# EAGLE design Oxport Project (EAGLE 9.6.2)
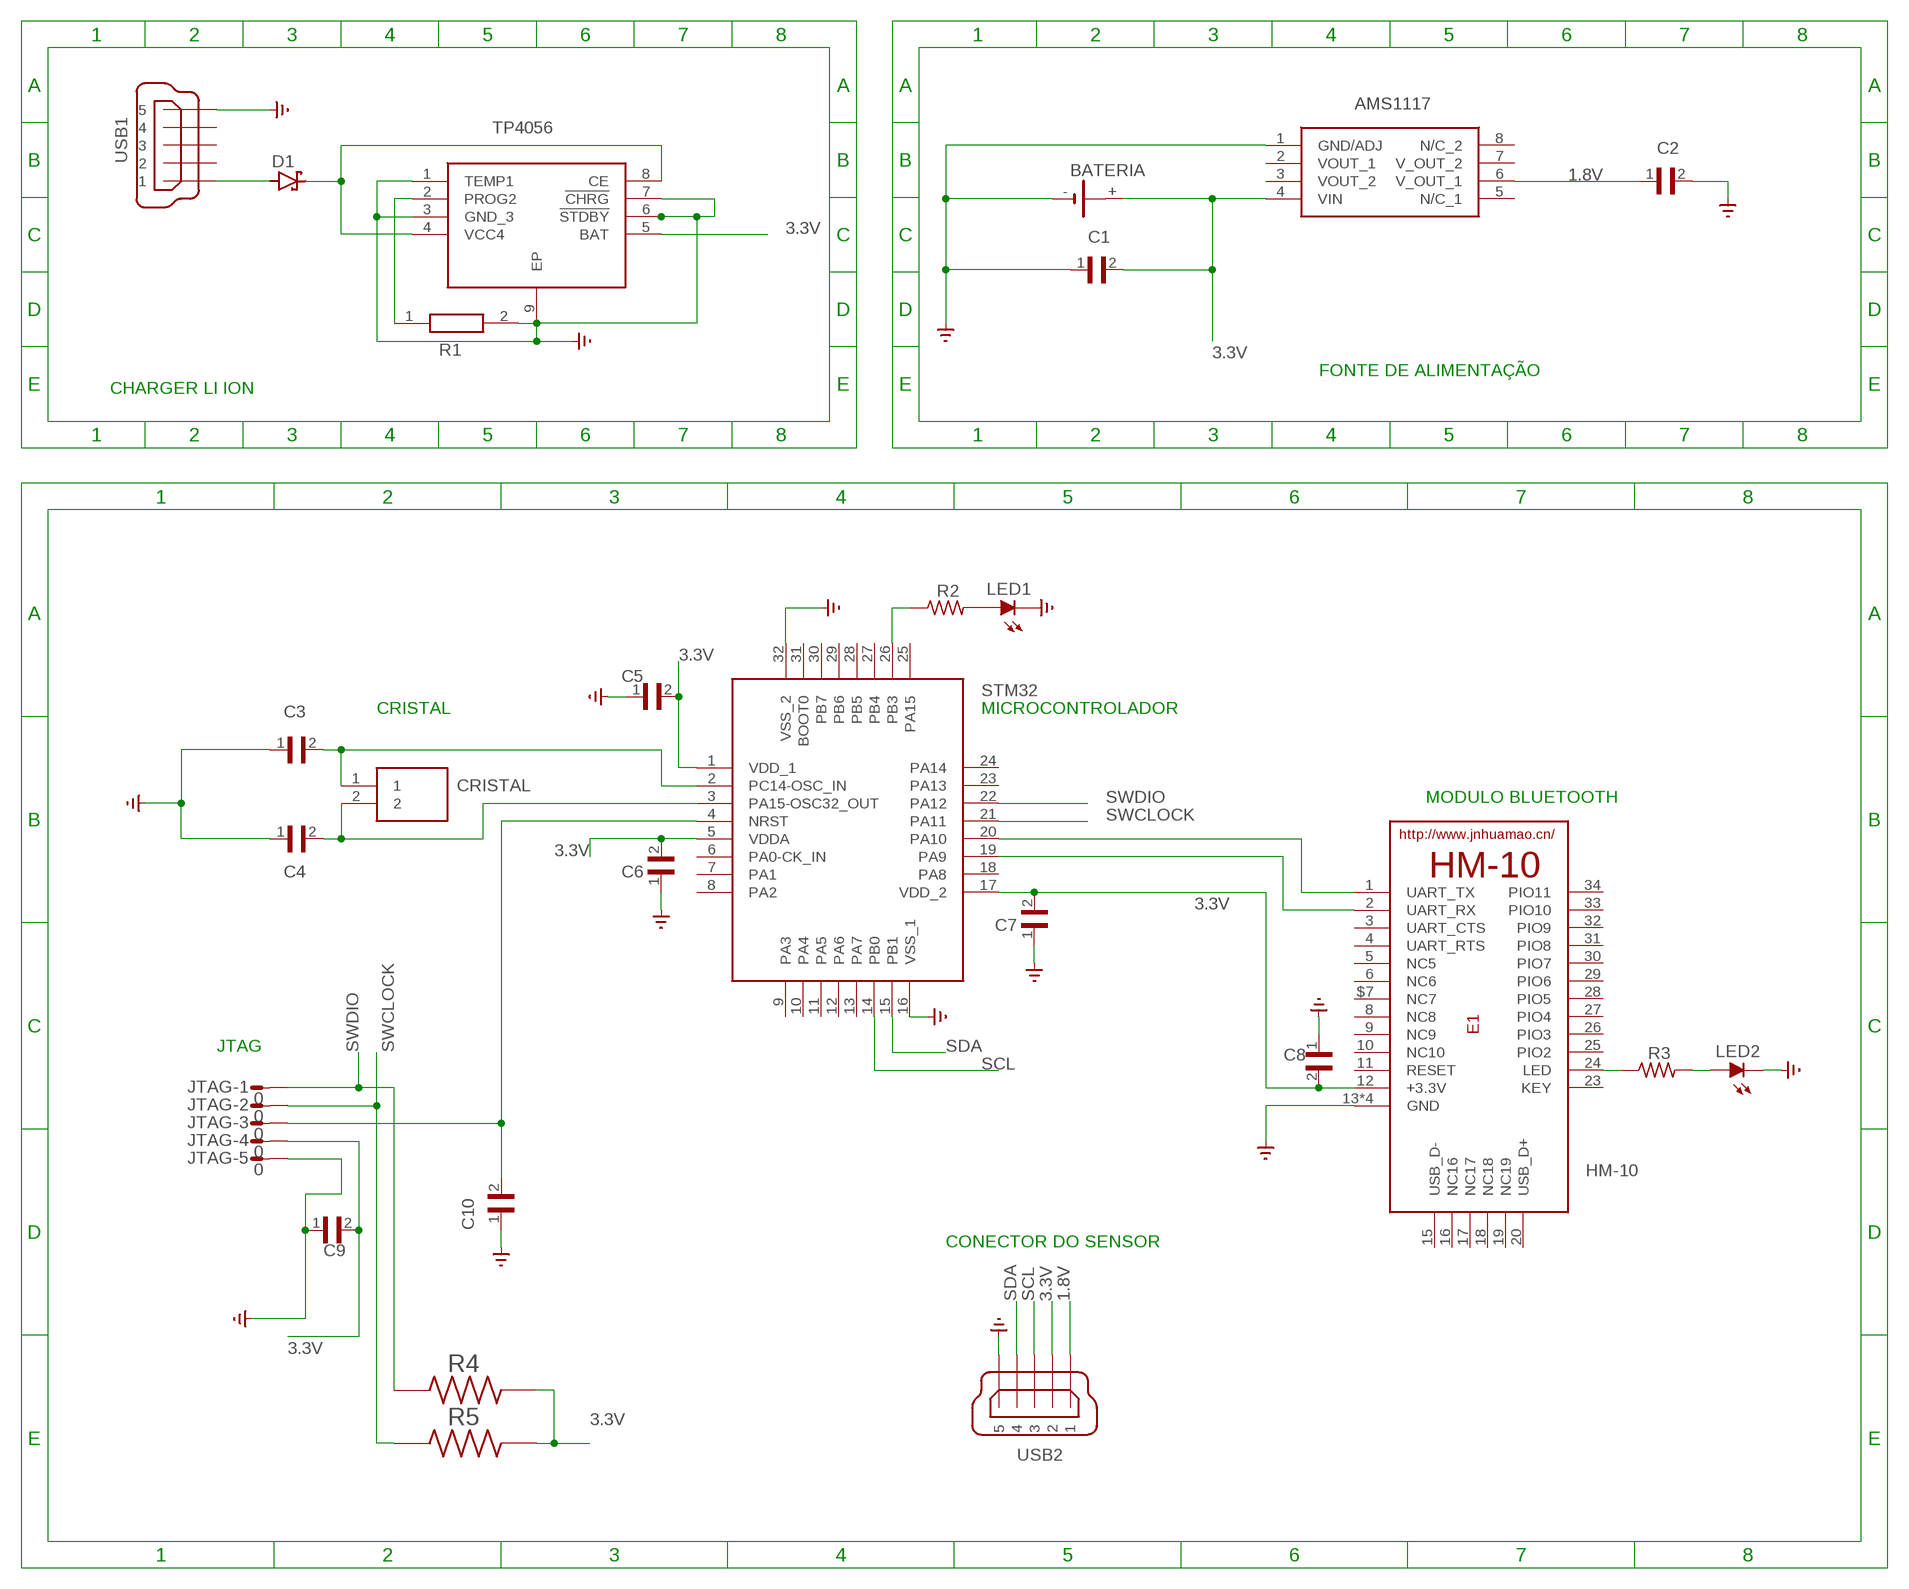
[diagram p0: schematic, sheet 1]

## Parts
3.3V  STM32L031K6T6TR  [QFP80P900X900X160-32N]
BATERIA  CR1/2  [CR1/2]
C1  VJ0603Y104KLXAC5G  [CAPC1608X92N]
C2  VJ0603Y104KLXAC5G  [CAPC1608X92N]
C3  GRM1885C2A4R3CZ01D  [CAPC1608X90N]
C4  GRM1885C2A4R3CZ01D  [CAPC1608X90N]
C5  VJ0603Y104KLXAC5G  [CAPC1608X92N]
C6  VJ0603Y104KLXAC5G  [CAPC1608X92N]
C7  VJ0603Y104KLXAC5G  [CAPC1608X92N]
C8  VJ0603Y104KLXAC5G  [CAPC1608X92N]
C9  VJ0603Y104KLXAC5G  [CAPC1608X92N]
C10  VJ0603Y104KLXAC5G  [CAPC1608X92N]
CRISTAL  NX3215SA-32.768K-EXS00A-MU0000  [NX3215SA32768KEXS00AMU00003]
D1  BAT60J  [SOD323_ST]
E1  HM-10-BOARD  [26.9X13X2.2_BOARD]
IC2  AMS1117CS-1.8  [SOIC127P599X175-8N]
J1  TP4056  [SOIC127P600X175-9N]
JTAG  0  L05P  [L05P]
LED1  1  LED_LEDCHIP-LED0603MP  [LED_CHIP-LED0603MP]
LED2  1  LED_LEDCHIP-LED0603MP  [LED_CHIP-LED0603MP]
MINI_USB  MINI-USB_SHIELD5P4-32005-501  [32005-501]
R1  CRCW08051K00FKEB  [RESC2012X50N]
R2  1623232-1  [RESC2012X65N]
R3  1623232-1  [RESC2012X65N]
R4  CRGCQ1206J10K  [RESC3115X65N]
R5  CRGCQ1206J10K  [RESC3115X65N]
USB1  MINI-USB_SHIELD5P4-32005-501  [32005-501]

## Nets
1.8V: C2.1 IC2.6(V_OUT_1) USB1.1
3.3V: 3.3V.1(VDD_1) 3.3V.5(VDDA) 3.3V.17(VDD_2) BATERIA.+ C1.2 C5.2 C6.2 C7.2 C8.2 C9.2 E1.12(+3.3V) IC2.4(VIN) J1.5(BAT) JTAG.4 R4.2 R5.2 USB1.2
GND: 3.3V.16(VSS_1) 3.3V.32(VSS_2) BATERIA.- C1.1 C2.2 C3.1 C4.1 C5.1 C6.1 C7.1 C8.1 C9.1 C10.1 E1.13(GND) E1.14(GND) E1.21(GND) E1.22(GND) IC2.1(GND/ADJ) J1.1(TEMP1) J1.3(GND_3) J1.6(!STDBY) J1.7(!CHRG) J1.9(EP) JTAG.5 LED1.C LED2.C MINI_USB.5 R1.2 USB1.5 ; supply symbol labelled SUPPLY0_GND_
N$1: D1.A MINI_USB.1
N$2: 3.3V.2(PC14-OSC_IN) C3.2 CRISTAL.1
N$3: 3.3V.3(PA15-OSC32_OUT) C4.2 CRISTAL.2
N$5: 3.3V.20(PA10) E1.1(UART_TX)
N$6: 3.3V.19(PA9) E1.2(UART_RX)
N$7: 3.3V.26(PB3) R2.1
N$8: E1.24(LED) R3.1
N$9: LED2.A R3.2
N$11: LED1.A R2.2
N$12: D1.C J1.4(VCC4) J1.8(CE)
N$14: J1.2(PROG2) R1.1
RESET: 3.3V.4(NRST) C10.2 JTAG.3
SCL: 3.3V.14(PB0) USB1.3
SDA: 3.3V.15(PB1) USB1.4
SWCLOCK: 3.3V.21(PA11) JTAG.2 R5.1
SWDIO: 3.3V.22(PA12) JTAG.1 R4.1
Unconnected: 3.3V.6(PA0-CK_IN) 3.3V.7(PA1) 3.3V.8(PA2) 3.3V.9(PA3) 3.3V.10(PA4) 3.3V.11(PA5) 3.3V.12(PA6) 3.3V.13(PA7) 3.3V.18(PA8) 3.3V.23(PA13) 3.3V.24(PA14) 3.3V.25(PA15) 3.3V.27(PB4) 3.3V.28(PB5) 3.3V.29(PB6) 3.3V.30(PB7) 3.3V.31(BOOT0) BATERIA.+@1(+) E1.3(UART_CTS) E1.4(UART_RTS) E1.5(NC5) E1.6(NC6) E1.8(NC8) E1.9(NC9) E1.10(NC10) E1.11(RESET) E1.15(USB_D-) E1.16(NC16) E1.17(NC17) E1.18(NC18) E1.19(NC19) E1.20(USB_D+) E1.23(KEY) E1.25(PIO2) E1.26(PIO3) E1.27(PIO4) E1.28(PIO5) E1.29(PIO6) E1.30(PIO7) E1.31(PIO8) E1.32(PIO9) E1.33(PIO10) E1.34(PIO11) E1.$7(NC7) IC2.2(VOUT_1) IC2.3(VOUT_2) IC2.5(N/C_1) IC2.7(V_OUT_2) IC2.8(N/C_2) MINI_USB.2 MINI_USB.3 MINI_USB.4 MINI_USB.M1(S1) MINI_USB.M2(S2) MINI_USB.M3(S3) MINI_USB.M4(S4) USB1.M1(S1) USB1.M2(S2) USB1.M3(S3) USB1.M4(S4)

## Notes on the sheet
- AMS1117
- USB1
- FONTE DE ALIMENTAÇÃO
- CHARGER LI ION
- STM32
- CRISTAL | MICROCONTROLADOR
- MODULO BLUETOOTH
- JTAG
- HM-10
- CONECTOR DO SENSOR
- USB2

## Library data of the parts
3.3V = STM32L031K6T6TR:STM32L031K6T6TR: STMICROELECTRONICS - STM32L031K6T6TR - ARM MCU, STM32 Family STM32L0 Series Microcontrollers, ARM Cortex-M0+, 32bit, 32 MHz, 32 KB, 8 KB Source: Datasheet <https://4donline.ihs.com/images/VipMasterIC/IC/SGST/SGST-S-A0002219924/SGST-S-A0002219924-1.pdf?hkey=6D3A4C79FDBF58556ACFDE234799DDF0>; ARROW_PART_NUMBER: STM32L031K6T6TR; ARROW_PRICE-STOCK: https://www.arrow.com/en/products/stm32l031k6t6tr/stmicroelectronics; DESCRIPTION: STMICROELECTRONICS - STM32L031K6T6TR - ARM MCU, STM32 Family STM32L0 Series Microcontrollers, ARM Cortex-M0+, 32bit, 32 MHz, 32 KB, 8 KB; HEIGHT: 1.6mm; MANUFACTURER_NAME: STMicroelectronics; MANUFACTURER_PART_NUMBER: STM32L031K6T6TR; MOUSER_PART_NUMBER: 511-STM32L031K6T6TR; MOUSER_PRICE-STOCK: https://www.mouser.co.uk/ProductDetail/STMicroelectronics/STM32L031K6T6TR/?qs=xwQlLnDx56Cmxri8cgW0QQ%3D%3D
BATERIA = battery:CR1/2: LI BATTERY Sonnenschein SL-350 PT
C1 C2 C5-C10 = VJ0603Y104KLXAC5G:VJ0603Y104KLXAC5G: Multilayer Ceramic Capacitors MLCC - SMD/SMT 100nF 25volts 10% Check prices <https://pricing.snapeda.com/parts/VJ0603Y104KLXAC5G/Vishay/view-part?ref=eda>; AVAILABILITY: Warning; DESCRIPTION: Multilayer Ceramic Capacitors MLCC - SMD/SMT 100nF 25volts 10%; MF: Vishay; MP: VJ0603Y104KLXAC5G; PACKAGE: 0603 Vishay; PRICE: None; PURCHASE-URL: https://pricing.snapeda.com/search/part/VJ0603Y104KLXAC5G/?ref=eda
C3 C4 = GRM1885C2A4R3CZ01D:GRM1885C2A4R3CZ01D: Check prices <https://pricing.snapeda.com/parts/GRM1885C2A4R3CZ01D/Murata/view-part?ref=eda>; AVAILABILITY: Bad; DESCRIPTION: 4.3pF ±0.25pF 100V Ceramic Capacitor C0G, NP0 0603 (1608 Metric); MF: Murata; MP: GRM1885C2A4R3CZ01D; PACKAGE: 1608 Murata; PRICE: None
CRISTAL = NX3215SA-32.768K-EXS00A-MU0000:NX3215SA-32.768K-EXS00A-MU0000: Crystals CRYSTAL 32.768KHZ 12.5PF SMD Source: Datasheet <https://media.digikey.com/pdf/Data Sheets/NDK PDFs/NX3215SA-32.768kHz-EXS00A-MU00003.pdf>; DESCRIPTION: Crystals CRYSTAL 32.768KHZ 12.5PF SMD; HEIGHT: 0.9mm; MANUFACTURER_NAME: NDK; MANUFACTURER_PART_NUMBER: NX3215SA-32.768K-EXS00A-MU00003; MOUSER_PART_NUMBER: 344-NX3215SA32.768K3; MOUSER_PRICE-STOCK: https://www.mouser.co.uk/ProductDetail/NDK/NX3215SA-32768K-EXS00A-MU00003?qs=w%2Fv1CP2dgqrE9YNksyAN9A%3D%3D
D1 = diode:BAT60J: Schottky barrier diode Source: www.st.com, BAT60J.pdf
E1 = JNHuaMao:HM-10: HM Bluetooth module use TI CC2540 or CC2541, Master and slave roles in one, transmission version and remote control version and PIO state acquisition functions in one, Support the AT command modify module parameters, Convenient and flexible.
IC2 = AMS1117CS-1.8:AMS1117CS-1.8: 1A LOW DROPOUT VOLTAGE REGULATOR Source: Datasheet <https://datasheet.datasheetarchive.com/originals/distributors/Datasheets-28/DSA-550594.pdf>; DESCRIPTION: 1A LOW DROPOUT VOLTAGE REGULATOR; HEIGHT: 1.752mm; MANUFACTURER_NAME: Advanced Monolithic Systems; MANUFACTURER_PART_NUMBER: AMS1117CS-1.8
J1 = TP4056:TP4056: 1A Standalone Linear Li-lon Battery Charger, SOP-8 Source: Datasheet <https://dlnmh9ip6v2uc.cloudfront.net/datasheets/Prototyping/TP4056.pdf>; DESCRIPTION: 1A Standalone Linear Li-lon Battery Charger, SOP-8; HEIGHT: 1.75mm; MANUFACTURER_NAME: NanJing Top Power; MANUFACTURER_PART_NUMBER: TP4056
JTAG = con-amp-mt:L05P: AMP MT CONNECTOR; OC_FARNELL: unknown; OC_NEWARK: unknown
LED1 LED2 = 52101-101-REV-A_v16:LED_LED: LED Various Types
MINI_USB USB1 = con-cypressindustries:MINI-USB_SHIELD5P4-: MINI USB-B R/A W/O POST 5 pol. Source: www.cypressindustries.com; OC_FARNELL: unknown; OC_NEWARK: unknown
R1 = CRCW08051K00FKEB:CRCW08051K00FKEB: VISHAY - CRCW08051K00FKEB - RES, THICK FILM, 1K, 1%, 0.125W, 0805, REEL Source: Datasheet <http://www.vishay.com/docs/20035/dcrcwe3.pdf>; ARROW_PART_NUMBER: CRCW08051K00FKEB; ARROW_PRICE-STOCK: https://www.arrow.com/en/products/crcw08051k00fkeb/vishay; DESCRIPTION: VISHAY - CRCW08051K00FKEB - RES, THICK FILM, 1K, 1%, 0.125W, 0805, REEL; HEIGHT: 0.5mm; MANUFACTURER_NAME: Vishay; MANUFACTURER_PART_NUMBER: CRCW08051K00FKEB; MOUSER_PART_NUMBER: 71-CRCW08051K00FKEB; MOUSER_PRICE-STOCK: https://www.mouser.co.uk/ProductDetail/Vishay-Dale/CRCW08051K00FKEB/?qs=DZvKvnD5UYWgZ7Jd5X5uKQ%3D%3D
R2 R3 = 1623232-1:1623232-1: CRG0805 1% 470R Check prices <https://pricing.snapeda.com/parts/1623232-1/TE%20Connectivity/view-part?ref=eda>; AVAILABILITY: Warning; COMMENT: 1623232-1; DESCRIPTION: 470 Ohms ±1% 0.125W, 1/8W Chip Resistor 0805 (2012 Metric) Thick Film; EU_ROHS_COMPLIANCE: Compliant with Exemptions; MF: TE Connectivity; MP: 1623232-1; PACKAGE: 0805; POWER_RATING: .125 W; PRICE: None; RESISTANCE: 470; TOLERANCE: 1%; VOLTAGE_RATING: 150 V
R4 R5 = CRGCQ1206J10K:CRGCQ1206J10K: Fixed Resistor CRGCQ 1206 10K 5% Check prices <https://pricing.snapeda.com/parts/CRGCQ1206J10K/TE%20Connectivity/view-part?ref=eda>; AVAILABILITY: Warning; COMMENT: 2-2176344-5; DESCRIPTION: Fixed Resistor CRGCQ 1206 10K 5%; MF: TE Connectivity; MP: CRGCQ1206J10K; PACKAGE: 3115 TE Connectivity; PRICE: None; PURCHASE-URL: https://pricing.snapeda.com/search/part/CRGCQ1206J10K/?ref=eda

## Board
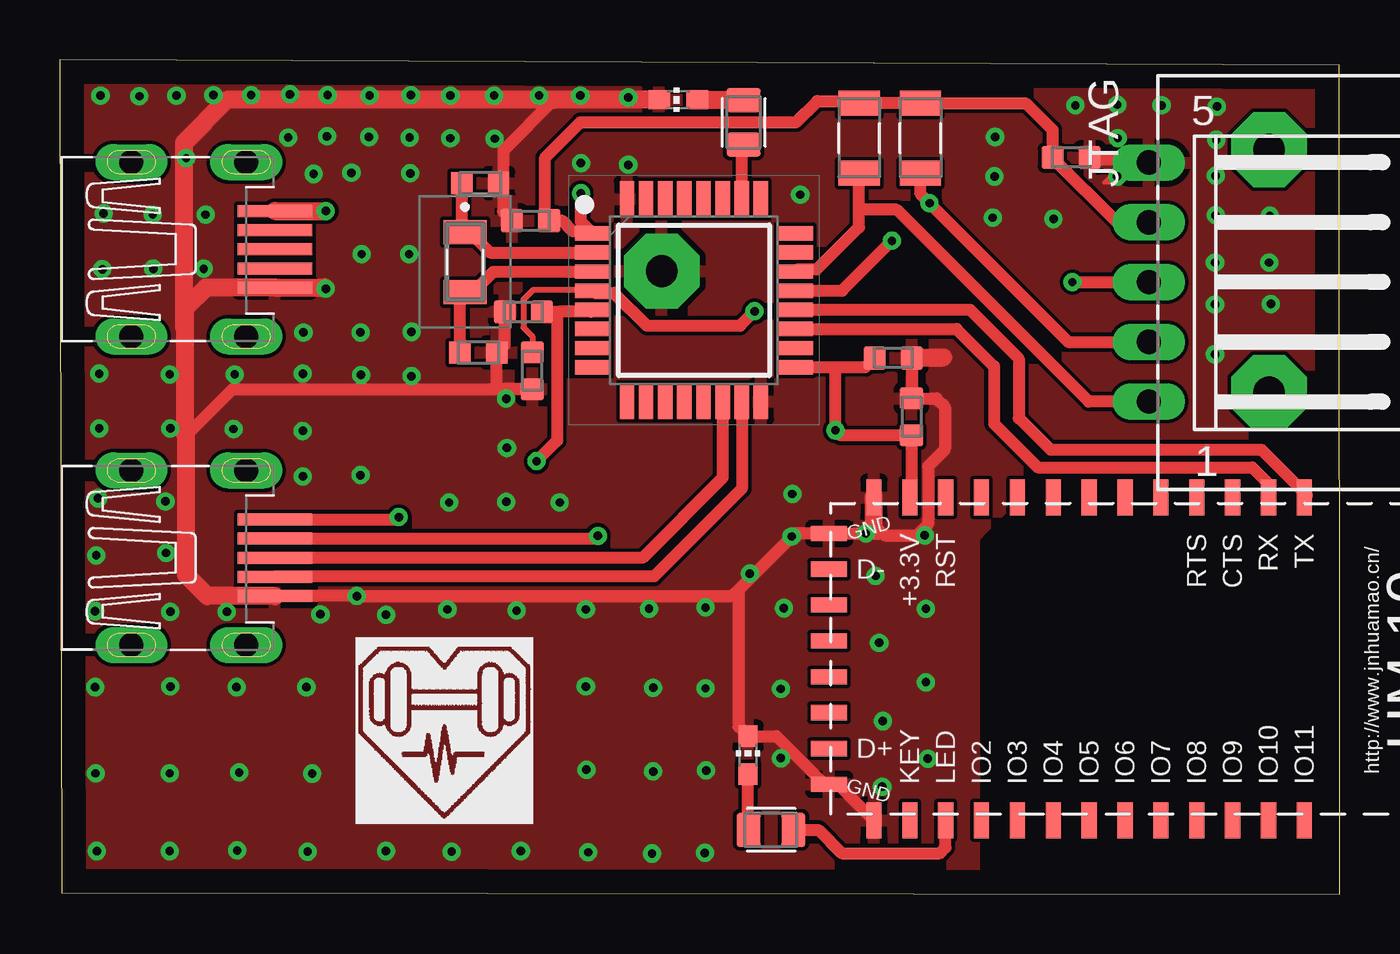
[diagram p1: board, top side]
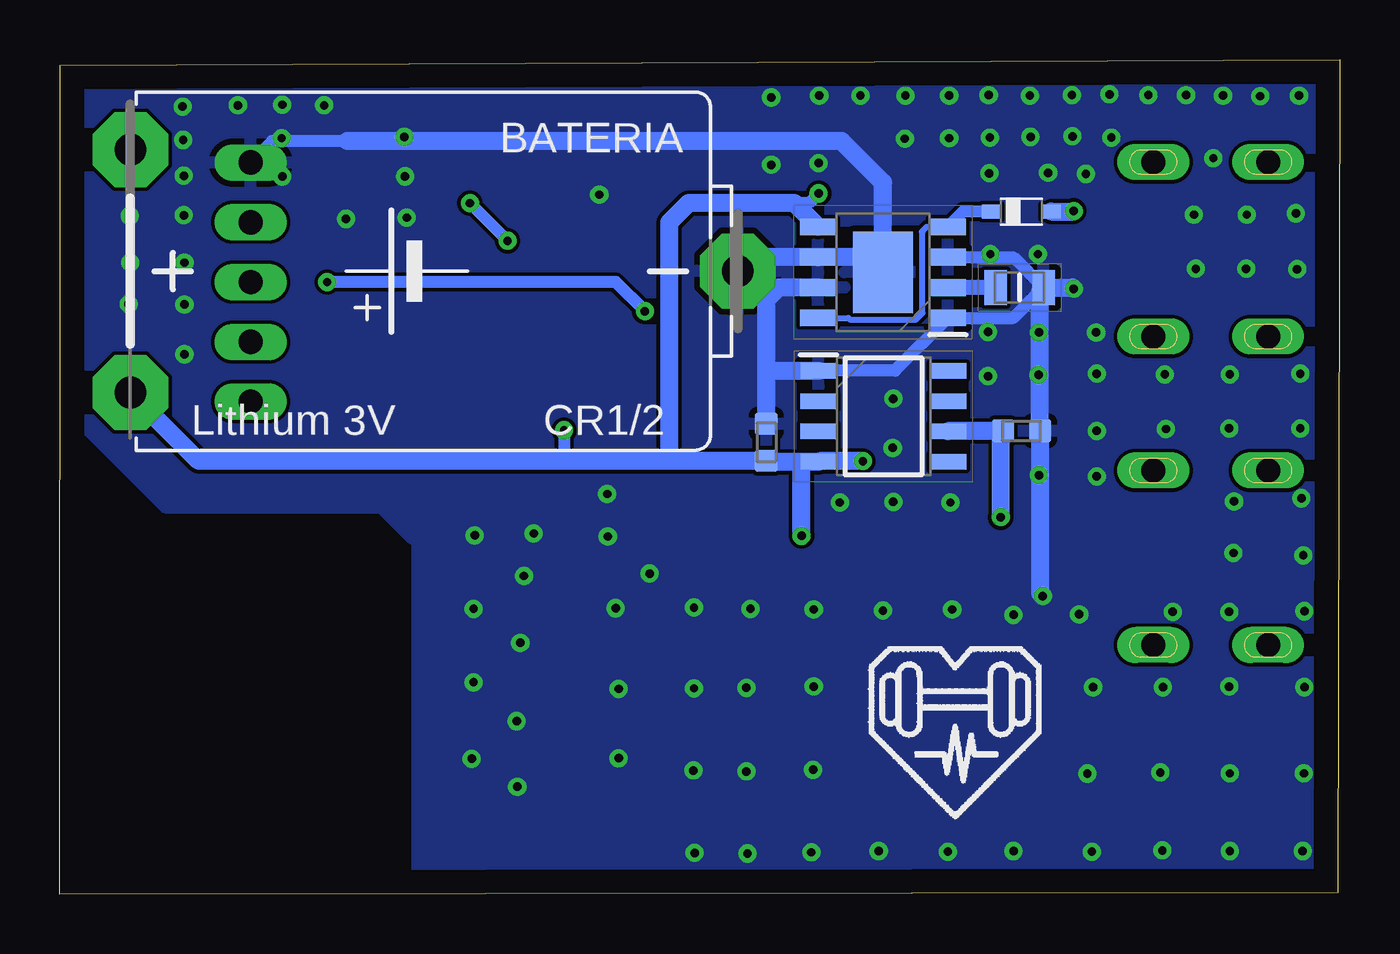
[diagram p2: board, bottom side, seen from below]

Size 53.52 x 34.9 mm. Coordinates in mm from the lower left corner, seen from the top.
Outline: 0.08,0.05 53.52,0 53.5,34.67 0,34.9 0.08,0.05
Copper layers (1*16): Top 0.035mm / dielectric 1.5mm / Bottom 0.035mm
Design rules "default": minimum track width 6mil, minimum drill 0.35mm, track to track 6mil, track to pad 6mil, pad to pad 6mil, via to via 6mil, smd to smd 6mil, copper to edge 40mil, drill to drill 6mil, minimum pad ring 10mil, minimum via ring 8mil, stop-mask expansion 4mil, vias tented up to drill 0mil, thermal gap 10mil

### Footprints (pad centres in the part's own frame; a part is rotated, then mirrored left to right if it is on the bottom)
QFP80P900X900X160-32N = smd 1.475 x 0.6: 1 -4.238,2.8; 2 -4.238,2; 3 -4.238,1.2; 4 -4.238,0.4; 5 -4.238,-0.4; 6 -4.238,-1.2; 7 -4.238,-2; 8 -4.238,-2.8; 17 4.238,-2.8; 18 4.238,-2; 19 4.238,-1.2; 20 4.238,-0.4; 21 4.238,0.4; 22 4.238,1.2; 23 4.238,2; 24 4.238,2.8 | smd 0.6 x 1.475: 9 -2.8,-4.238; 10 -2,-4.238; 11 -1.2,-4.238; 12 -0.4,-4.238; 13 0.4,-4.238; 14 1.2,-4.238; 15 2,-4.238; 16 2.8,-4.238; 25 2.8,4.238; 26 2,4.238; 27 1.2,4.238; 28 0.4,4.238; 29 -0.4,4.238; 30 -1.2,4.238; 31 -2,4.238; 32 -2.8,4.238
CR1/2 = drill 1.321 pad 3.15 octagon: + -12.7,-5.08; +@1 -12.7,5.08; - 12.7,0
CAPC1608X92N = smd 0.92 x 0.97: 1 -0.775,0; 2 0.775,0
CAPC1608X90N = smd 0.89 x 0.93: 1 -0.77,0; 2 0.77,0
NX3215SA32768KEXS00AMU00003 = smd 1 x 1.8: 1 -1.25,0; 2 1.25,0
SOD323_ST = smd 0.8 x 0.6: A 1.25,0; C -1.25,0
26.9X13X2.2_BOARD = smd 1.5 x 0.635: 1 -7.5,0; 2 -7.5,-1.5; 3 -7.5,-3; 4 -7.5,-4.5; 5 -7.5,-6; 6 -7.5,-7.5; 8 -7.5,-10.5; 9 -7.5,-12; 10 -7.5,-13.5; 11 -7.5,-15; 12 -7.5,-16.5; 13 -7.5,-18; 22 6,-18; 23 6,-16.5; 24 6,-15; 25 6,-13.5; 26 6,-12; 27 6,-10.5; 28 6,-9; 29 6,-7.5; 30 6,-6; 31 6,-4.5; 32 6,-3; 33 6,-1.5; 34 6,0; $7 -7.5,-9 | smd 0.635 x 1.5: 14 -6,-19.875; 15 -4.5,-19.875; 16 -3,-19.875; 17 -1.5,-19.875; 18 0,-19.875; 19 1.5,-19.875; 20 3,-19.875; 21 4.5,-19.875
SOIC127P599X175-8N = smd 1.526 x 0.65: 1 -2.712,1.905; 2 -2.712,0.635; 3 -2.712,-0.635; 4 -2.712,-1.905; 5 2.712,-1.905; 6 2.712,-0.635; 7 2.712,0.635; 8 2.712,1.905
SOIC127P600X175-9N = smd 1.525 x 0.7: 1 -2.712,1.905; 2 -2.712,0.635; 3 -2.712,-0.635; 4 -2.712,-1.905; 5 2.712,-1.905; 6 2.712,-0.635; 7 2.712,0.635; 8 2.712,1.905 | smd 2.513 x 3.402: 9 0,0
L05P = drill 1.016 long: 1 5,-6.25; 2 2.5,-6.25; 3 0,-6.25; 4 -2.5,-6.25; 5 -5,-6.25
LED_CHIP-LED0603MP = smd 0.8 x 0.9: A 0,-0.794; C 0,0.794
32005-501 = smd 3.1 x 0.5: 1 3,1.6; 2 3,0.8; 3 3,0; 4 3,-0.8; 5 3,-1.6 | drill 1 pad 1.422 long: M1 -3,3.65; M2 -3,-3.65; M3 1.8,3.65; M4 1.8,-3.65
RESC2012X50N = smd 0.95 x 1.45: 1 -1,0; 2 1,0
RESC2012X65N = smd 1 x 1.42: 1 -0.935,0; 2 0.935,0
RESC3115X65N = smd 1.05 x 1.72: 1 -1.46,0; 2 1.46,0

### Placement (x,y rotation side)
3.3V  26.52,24.84 0 top
BATERIA  37.87,26.06 0 bottom
C1  23.98,18.9 270 bottom
C2  13.31,19.38 0 bottom
C3  17.58,29.74 180 top
C4  17.5,22.66 180 top
C5  19.68,28.17 0 top
C6  34.85,22.43 180 top
C7  19.38,24.36 0 top
C8  35.61,19.96 270 top
C9  42.29,30.81 180 top
C10  19.76,21.89 90 top
CRISTAL  16.94,26.44 270 top
D1  13.31,28.55 0 bottom
E1  52.04,9.09 270 top
IC2  19.08,19.99 0 bottom
J1  19.1,26.01 180 bottom
JTAG  51.79,25.6 270 top
LED1  25.86,33.22 90 top
LED2  28.78,5.82 0 top
MINI_USB  5.99,26.97 0 top
R1  13.39,25.37 0 bottom
R2  28.6,32.28 90 top
R3  29.74,2.69 180 top
R4  33.43,31.62 90 top
R5  35.99,31.62 90 top
USB1  5.99,14.07 0 top

### Tracks (layer width: path | path; a pad name or v marks a point on that pad's centre or on a via)
1.8V  (via drill 0.35)
  Top 0.254: 14.07,15.67 v14.17,15.77
  Top 0.508: USB1.1 14.07,15.67
  Bottom 0.254: 14.17,19.29 C2.1
  Bottom 0.762: C2.1 16.34,19.38 IC2.6 | v14.17,15.77 14.17,19.29
3.3V  (via drill 0.35)
  Top 0.254: 22.2,24.36 3.3V.5 | C5.2 20.29,28.33 | 33.34,33.17 R4.2 | 22.39,14.87 v22.5,14.99
  Top 0.508: C7.2 20.88,24.36 | 22.2,24.36 20.88,24.36 | C5.2 21.02,28.17 21.47,27.72 22.2,27.72 3.3V.1 21.79,28.13 v21.79,29.31 | 20.29,28.33 20.29,30.81 21.77,32.28 30.78,32.28 31.67,33.17 33.34,33.17 | R4.2 R5.2 40.4,33.08 41.52,31.97 C9.2 44.22,28.1 JTAG.4 | USB1.2 22.39,14.87 | 3.3V.17 32.46,22.04 | 32.46,22.04 33.69,22.04 C6.2 | 32.46,22.04 32.44,22.02 v32.44,19.41 32.65,19.19 C8.2 35.61,16.66 E1.12 | 20.88,24.36 20.8,24.28 20.8,18.97 v19.94,18.11
  Bottom 0.152: 50.52,20.93 BATERIA.+
  Bottom 0.254: 23.94,18.08 C1.2 | 22.5,17.96 22.63,18.08 | 32.44,18.15 32.41,18.12
  Bottom 0.508: v32.44,19.41 32.44,18.15 | v21.79,29.31 22.2,28.91 22.8,28.91
  Bottom 0.762: 23.94,18.08 22.63,18.08 IC2.4 21.76,18.11 v19.94,18.11 | C1.2 28.04,18.12 | 28.04,18.12 32.41,18.12 47.71,18.12 50.52,20.93 | J1.5 22.8,28.91 27.23,28.91 28.04,28.09 28.04,18.12 | v22.5,14.99 22.5,17.96
GND  (via drill 0.35)
  Top 0.152: v44.22,30.02 43.97,29.77 43.66,29.77 44.5,30.6 JTAG.5
  Top 0.254: 11.07,25.37 v11.13,25.32 | 18.37,29.72 C3.1 | 35.61,22.42 C6.1 35.65,22.45 | 32.54,15.09 E1.14 | C8.1 35.67,20.68 35.75,20.75 | 31.98,4.59 E1.21
  Top 0.508: C5.1 18.53,28.55 18.53,29.44 18.55,29.46 18.55,29.74 | 18.55,29.74 18.55,31.1 20.68,33.22 | USB1.5 v12.42,12.47 28.12,12.47 28.37,12.73 | USB1.5 | C3.1 18.55,29.74 | E1.22 32.54,4.59 E1.21 | 31.98,4.59 29.97,6.61 LED2.C 28.37,7.02 28.37,12.73 | E1.14 30.74,15.09 28.37,12.73 | C6.1 35.62,20.73 35.67,20.68 | C8.1 36.66,20.74 37.01,20.4 37.01,18.59 36.32,17.91 36.32,15.67 36.32,15.49 35.84,15.01 34.49,15.01 34.41,15.09 | 34.41,15.09 34.04,15.46 | C7.1 18.6,22.99 C4.1 18.27,21.12 C10.1 7.23,21.12 5.28,19.18 | 32.54,15.09 34.41,15.09 | 5.18,23.72 5.23,23.67 | JTAG.5 45.41,30.73 43.15,30.73 C9.1
  Top 0.762: 11.07,25.37 MINI_USB.5 6.12,25.37 5.23,24.49 5.23,23.67 5.23,19.23 5.28,19.18 5.28,13.36 6.17,12.47 USB1.5 | LED1.C 20.68,33.22 6.98,33.22 5.18,31.42 5.18,23.72 | 35.65,22.45 36.93,22.45 | 34.04,15.46 E1.13
  Bottom 0.152: 21.84,25.55 21.84,25.4 J1.7 21.84,25.55
  Bottom 0.254: 11.18,25.37 v11.13,25.32 | 21.84,25.37 J1.7
  Bottom 0.508: IC2.1 18.6,21.89 J1.1 13.66,24.1 12.53,25.23 | J1.3 13.66,26.64 R1.2 | 41.5,31.5 44.65,31.5 JTAG.5
  Bottom 0.762: 11.18,25.37 R1.2 12.53,25.23 C2.2 12.53,12.59 v12.42,12.47 | C1.1 23.98,21.92 | 23.98,21.92 23.98,24.87 | 23.98,24.87 BATERIA.- 24.59,26.64 J1.6 19.74,26.64 J1.9 19.1,29.77 20.83,31.5 41.5,31.5 | 23.98,21.92 23.95,21.89 IC2.1 | 23.98,24.87 23.47,25.37 J1.7
  other vias: 1.7,33.4 3.33,33.38 4.88,33.4 6.43,33.43 8,33.43 9.63,33.45 11.2,33.43 12.95,33.4 14.68,33.43 16.33,33.4 18.16,33.4 20.04,33.4 21.77,33.4 23.77,33.32 42.47,32.99 44.22,33.02 46.08,32.99 48.39,32.94 44.25,31.62 48.34,28.4 48.34,30.05 48.36,31.55 50.6,28.37 50.65,24.69 48.31,24.66 48.31,22.58 50.57,26.42 48.31,26.42 30.96,29.26 21.79,30.58 18.19,31.6 16.33,31.62 14.63,31.65 12.93,31.67 11.18,31.7 9.55,31.65 5.28,30.78 1.83,28.47 3.89,28.42 6.1,28.42 6.02,26.16 3.91,26.16 1.78,26.14 1.65,21.77 4.6,21.74 7.32,21.74 10.16,21.77 12.6,21.72 10.16,19.38 7.26,19.46 4.62,19.48 1.65,19.48 1.6,16.56 1.52,14.17 1.47,11.84 18.67,20.73 18.69,18.67 18.67,16.41 20.9,16.38 16.28,16.38 14.71,23.52 12.57,23.49 14.71,21.67 14.6,26.77 12.62,26.77 1.47,8.66 4.62,11.81 6.98,11.81 10.9,11.71 13.64,11.68 16.21,11.91 19.1,11.86 22,11.91 24.64,11.94 27,11.99 28.85,13.41 30.61,14.96 30.28,11.96 27,8.61 4.62,8.69 7.39,8.66 10.31,8.66 7.5,5.09 10.55,5.05 27.03,5.18 22,8.69 24.82,8.64 24.82,5.13 22.02,5.21 16.38,1.78 13.64,1.8 19.28,1.8 22.1,1.75 24.77,1.7 26.97,1.73 10.36,1.78 7.42,1.83 4.6,1.8 1.55,1.8 4.6,5.05 1.5,5.05 10.16,17.48 4.42,16.43 4.45,14.27 10.19,23.49 30.63,16.74 33.71,15.09 36.17,15.01 36.22,11.94 36.22,8.86 36.3,5.66 34.11,13.31 34.26,10.52 34.42,7.24 30.15,8.59 30.15,5.69 39.09,30.02 39.12,31.67 34.39,4.5 14.66,30.15 12.19,30.18 10.62,30.12 12.57,17.53 23.77,30.51 39.01,28.3 41.55,28.24
  pour Top: 0.13,34.67 53.67,34.67 53.82,34.52 53.82,19.91 51.71,17.81 50.72,16.81 40.13,16.81 38.38,15.06 38.23,15.06 38.23,0.1 38.18,0.05 0.23,0.05 0.13,-0.05 0.13,34.57
  pour Bottom: 0.05,34.77 53.11,34.77 53.54,34.34 53.54,20.6 49.76,16.81 49.12,16.18 40.11,16.18 38.79,14.86 38.58,14.86 38.58,-0.08 0.23,-0.08 -0.08,0.23 -0.08,34.77
N$1  (via drill 0.35)
  Top 0.254: v11.12,28.57 v11.13,28.57
  Top 0.762: MINI_USB.1 v11.12,28.57
  Bottom 0.254: 11.15,28.55 v11.13,28.57
  Bottom 0.762: D1.A 11.15,28.55
N$2
  Top 0.254: CRISTAL.1 17.14,27.69
  Top 0.508: CRISTAL.1 16.81,27.83 C3.2 | 17.14,27.69 17.99,26.84 3.3V.2
N$3
  Top 0.254: CRISTAL.2 17.29,25.19
  Top 0.508: C4.2 16.73,24.98 CRISTAL.2 | 3.3V.3 22.26,26.02 18.12,26.02 17.29,25.19
N$5
  Top 0.254: 52.15,16.69 E1.1
  Top 0.508: 3.3V.20 38.07,24.44 40.11,22.4 40.11,19.91 41.43,18.59 50.25,18.59 52.15,16.69
N$6
  Top 0.254: 50.54,17.17 E1.2
  Top 0.508: 3.3V.19 37.5,23.64 39.07,22.07 39.07,19.68 40.89,17.86 49.86,17.86 50.54,17.17
N$7
  Top 0.254: 28.52,31.27 R2.1
  Top 0.508: 3.3V.26 28.52,31.27
N$8
  Top 0.508: R3.1 31.72,2.69 32.7,1.72 36.8,1.72 37.04,1.96 E1.24
N$9
  Top 0.508: R3.2 28.78,2.72 LED2.A
N$11
  Top 0.254: R2.2
  Top 0.762: LED1.A R2.2
N$12
  Bottom 0.254: J1.8 20.55,24.1 20.47,24.03 17.73,24.03 17.45,24.31 17.45,27.69 17.48,27.71 17.27,27.91 J1.4
  Bottom 0.508: D1.C 15.75,28.55 J1.4
N$14
  Bottom 0.152: J1.2 16.37,25.3 16.3,25.37
  Bottom 0.635: R1.1 16.3,25.37
RESET  (via drill 0.35)
  Top 0.254: C10.2 19.76,23.33 19.39,23.7 19.39,24.87 19.8,25.28 22.25,25.28 3.3V.4
  Top 0.508: 3.3V.4 22.37,25.15 23.19,25.15 24.56,23.77 28.45,23.77 v29.06,24.38 | v42.34,25.6 JTAG.3
  Bottom 0.508: v29.06,24.38 30.28,25.6 v42.34,25.6
SCL
  Top 0.508: 3.3V.14 27.72,17.43 24.36,14.07 USB1.3
SDA
  Top 0.508: 3.3V.15 28.52,16.96 24.85,13.3 18.08,13.3 9.02,13.3 USB1.4
SWCLOCK  (via drill 0.35)
  Top 0.508: 3.3V.21 32.71,25.24 v34.8,27.33 | R5.1 35.99,29.29 v36.37,28.91 42.17,23.1 JTAG.2
  Bottom 0.508: v34.8,27.33 v36.37,28.91
SWDIO
  Top 0.508: 3.3V.22 30.85,26.13 31.66,26.13 33.43,27.9 33.43,28.63 | 33.43,28.63 R4.1 | 33.43,28.63 35,28.63 43.02,20.6 JTAG.1